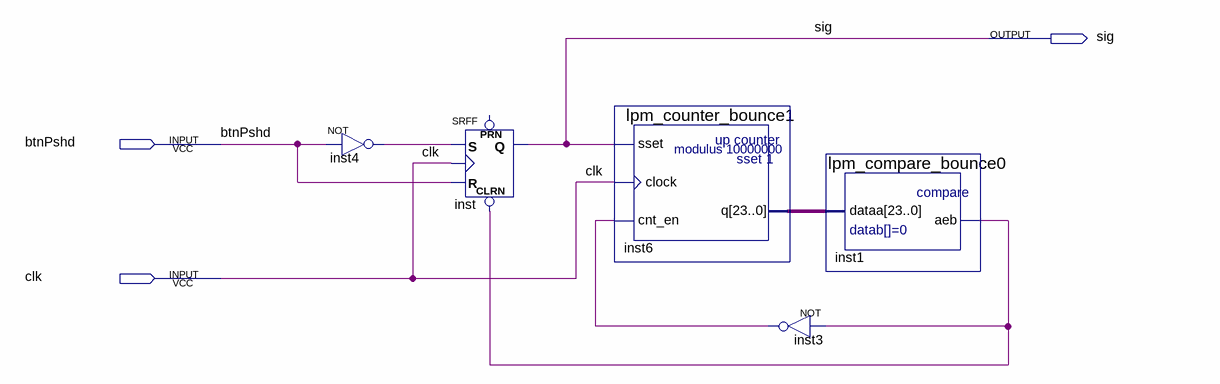
[diagram p0: schematic sheet]
// Quartus schematic g07_debouncer.bdf as structural Verilog: 5 symbols, 3 pins
module g07_debouncer (
  input  btnPshd,
  input  clk,
  output sig
);

  wire inst1_aeb, inst3_out, inst4_out;
  wire [23:0] inst6_q;

  not inst4 (inst4_out, btnPshd);
  SRFF inst (.CLRN(inst1_aeb), .S(inst4_out), .R(btnPshd), .CLK(clk), .Q(sig));  // open: PRN
  lpm_counter_bounce1 inst6 (.sset(sig), .clock(clk), .cnt_en(inst3_out), .q(inst6_q));
  lpm_compare_bounce0 inst1 (.dataa(inst6_q), .aeb(inst1_aeb));
  not inst3 (inst3_out, inst1_aeb);
endmodule
